# Altium schematic sheet Gateway.SCHDOC
size A4; SheetNumber: 1
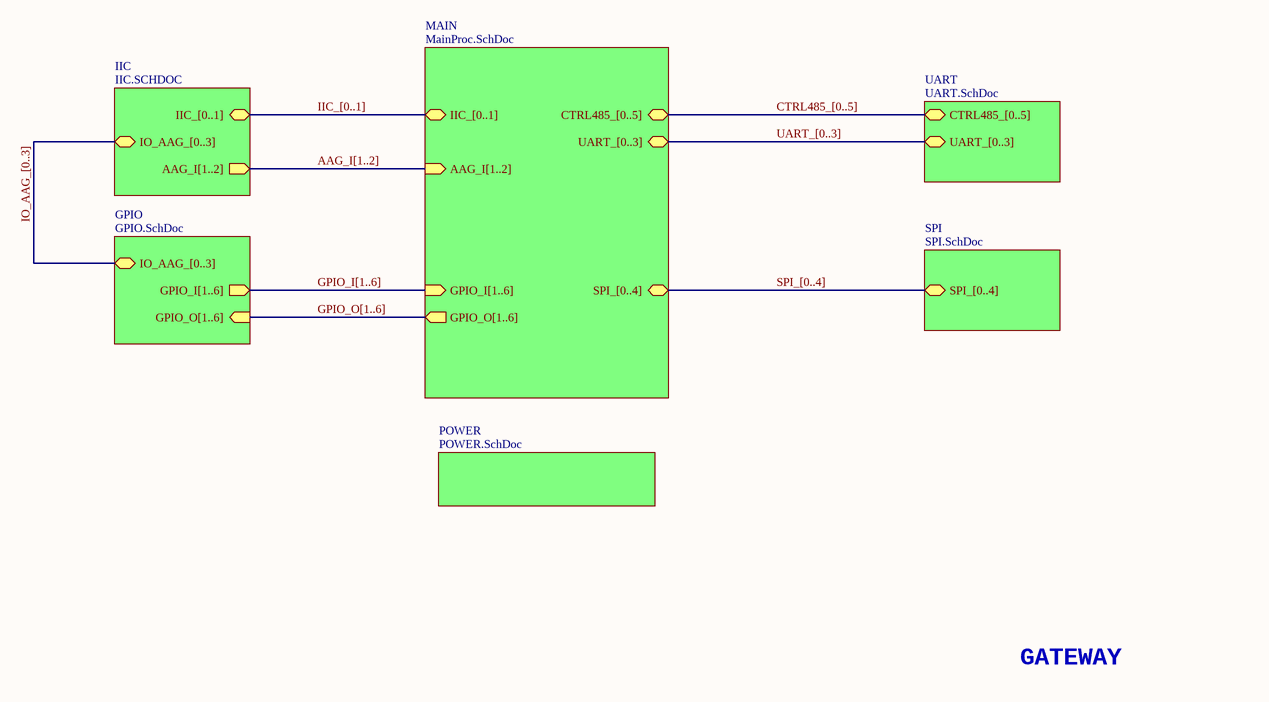
[diagram p0: Gateway.SCHDOC]

## Sub-sheets
GPIO = GPIO.SchDoc: GPIO_O[1..6] (in), GPIO_I[1..6] (out), IO_AAG_[0..3] (bidir)
IIC = IIC.SCHDOC: IIC_[0..1] (bidir), IO_AAG_[0..3] (bidir), AAG_I[1..2] (out)
MAIN = MainProc.SchDoc: SPI_[0..4] (bidir), UART_[0..3] (bidir), CTRL485_[0..5] (bidir), GPIO_I[1..6] (in), GPIO_O[1..6] (out), IIC_[0..1] (bidir), AAG_I[1..2] (in)
POWER = POWER.SchDoc: no entries
SPI = SPI.SchDoc: SPI_[0..4] (bidir)
UART = UART.SchDoc: UART_[0..3] (bidir), CTRL485_[0..5] (bidir)

## Buses and harness runs
bus AAG_I[1..2] = sheet IIC/AAG_I[1..2] = sheet MAIN/AAG_I[1..2]
bus CTRL485_[0..5] = sheet MAIN/CTRL485_[0..5] = sheet UART/CTRL485_[0..5]
bus GPIO_I[1..6] = sheet GPIO/GPIO_I[1..6] = sheet MAIN/GPIO_I[1..6]
bus GPIO_O[1..6] = sheet GPIO/GPIO_O[1..6] = sheet MAIN/GPIO_O[1..6]
bus IIC_[0..1] = sheet IIC/IIC_[0..1] = sheet MAIN/IIC_[0..1]
bus IO_AAG_[0..3] = sheet GPIO/IO_AAG_[0..3] = sheet IIC/IO_AAG_[0..3]
bus SPI_[0..4] = sheet MAIN/SPI_[0..4] = sheet SPI/SPI_[0..4]
bus UART_[0..3] = sheet MAIN/UART_[0..3] = sheet UART/UART_[0..3]

## Notes on the sheet
- GATEWAY